# Altium schematic sheet POWER_5.0V_6A.SchDoc
size A4
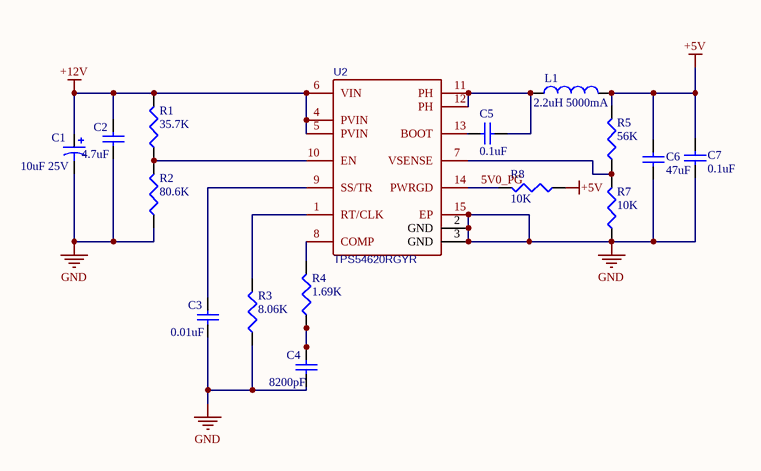
[diagram p0: POWER_5.0V_6A.SchDoc]

## Parts
C1  value 10uF 25V  [47UF_16V]  (hidden comment: Cap Pol1)
C2  value 4.7uF  [C1210]  (hidden comment: Cap Semi)
C3  value 0.01uF  [C1210]  (hidden comment: Cap Semi)
C4  value 8200pF  [C1210]  (hidden comment: Cap Semi)
C5  value 0.1uF  [C1210]  (hidden comment: Cap Semi)
C6  value 47uF  [C1210]  (hidden comment: Cap Semi)
C7  value 0.1uF  [C1210]  (hidden comment: Cap Semi)
L1  value 2.2uH 5000mA  [IND-SMD_L5.5-W5.2]  (hidden comment: Inductor)
R1  value 35.7K  [J1-0603]  (hidden comment: Res3)
R2  value 80.6K  [J1-0603]  (hidden comment: Res3)
R3  value 8.06K  [J1-0603]  (hidden comment: Res3)
R4  value 1.69K  [J1-0603]  (hidden comment: Res3)
R5  value 56K  [J1-0603]  (hidden comment: Res3)
R7  value 10K  [J1-0603]  (hidden comment: Res3)
R8  value 10K  [J1-0603]  (hidden comment: Res3)
U2  TPS54620RGYR  [VQFN-14_L3.5-W3.5-P0.50-TL-EP_TPS54622RHLT]

## Nets
+5V: C6.1 C7.1 L1.2 R5.2 R8.1
+12V: C1.1 C2.2 R1.2 U2.4(PVIN) U2.5(PVIN) U2.6(VIN)
GND: C1.2 C2.1 C3.1 C4.1 C6.2 C7.2 R2.1 R3.1 R7.1 U2.2(GND) U2.3(GND) U2.15(EP)
5V0_PG: R8.2 U2.14(PWRGD)
NetC3_2: C3.2 U2.9(SS/TR)
NetC4_2: C4.2 R4.1
NetC5_1: C5.1 L1.1 U2.11(PH) U2.12(PH)
NetC5_2: C5.2 U2.13(BOOT)
NetR1_1: R1.1 R2.2 U2.10(EN)
NetR3_2: R3.2 U2.1(RT/CLK)
NetR4_2: R4.2 U2.8(COMP)
NetR5_1: R5.1 R7.2 U2.7(VSENSE)

## Library data of the parts
C1 = Cap Pol1: Polarized Capacitor (Radial); Published: 8-Jun-2000; LatestRevisionDate: 17-Jul-2002; LatestRevisionNote: Re-released for DXP Platform.; PackageReference: RB7.6-15; Publisher: Altium Limited; PackageDescription: Polarized Capacitor (Radial); 2 Leads
C2-C7 = Cap Semi: Capacitor (Semiconductor SIM Model); Published: 8-Jun-2000; LatestRevisionDate: 29-May-2009; LatestRevisionNote: IPC-7351 Footprint Added.; PackageReference: C1206; Publisher: Altium Limited; PackageDescription: Chip Capacitor
L1 = Inductor: Code_IEC: 1005; Published: 8-Jun-2000; LatestRevisionDate: 29-May-2009; LatestRevisionNote: IPC-7351 Footprint Added.; PackageReference: 0402-A; Publisher: Altium Limited; PackageDescription: Chip Inductor; Code_JEITA: 0402
R1-R5 R7 R8 = Res3: Resistor; Published: 8-Jun-2000; LatestRevisionDate: 29-May-2009; LatestRevisionNote: IPC-7351 Footprint Added.; PackageReference: J1-0603; Publisher: Altium Limited; PackageDescription: Chip Resistor
U2 = TPS54620RGYR: BOM_Manufacturer: TI; BOM_Supplier: LCSC; BOM_Manufacturer Part: TPS54620RGYR; image: //image.lceda.cn/szlcsc/C29438.jpg; BOM_Supplier Part: C29438; spicePre: U; spiceSymbolName: TPS54620RGYR